# EAGLE design XuLA_VGA (EAGLE 5.11)
AUTHOR: Dave Vandenbout / XESS Corp.; DIGIKEY#: 742C083822JPCT-ND; JAMECO#: 68339; MANF: Jameco ValuePro; MANF#: SMH36; MOUSER#: 774-742C083561JP; VERSION#: 1.0
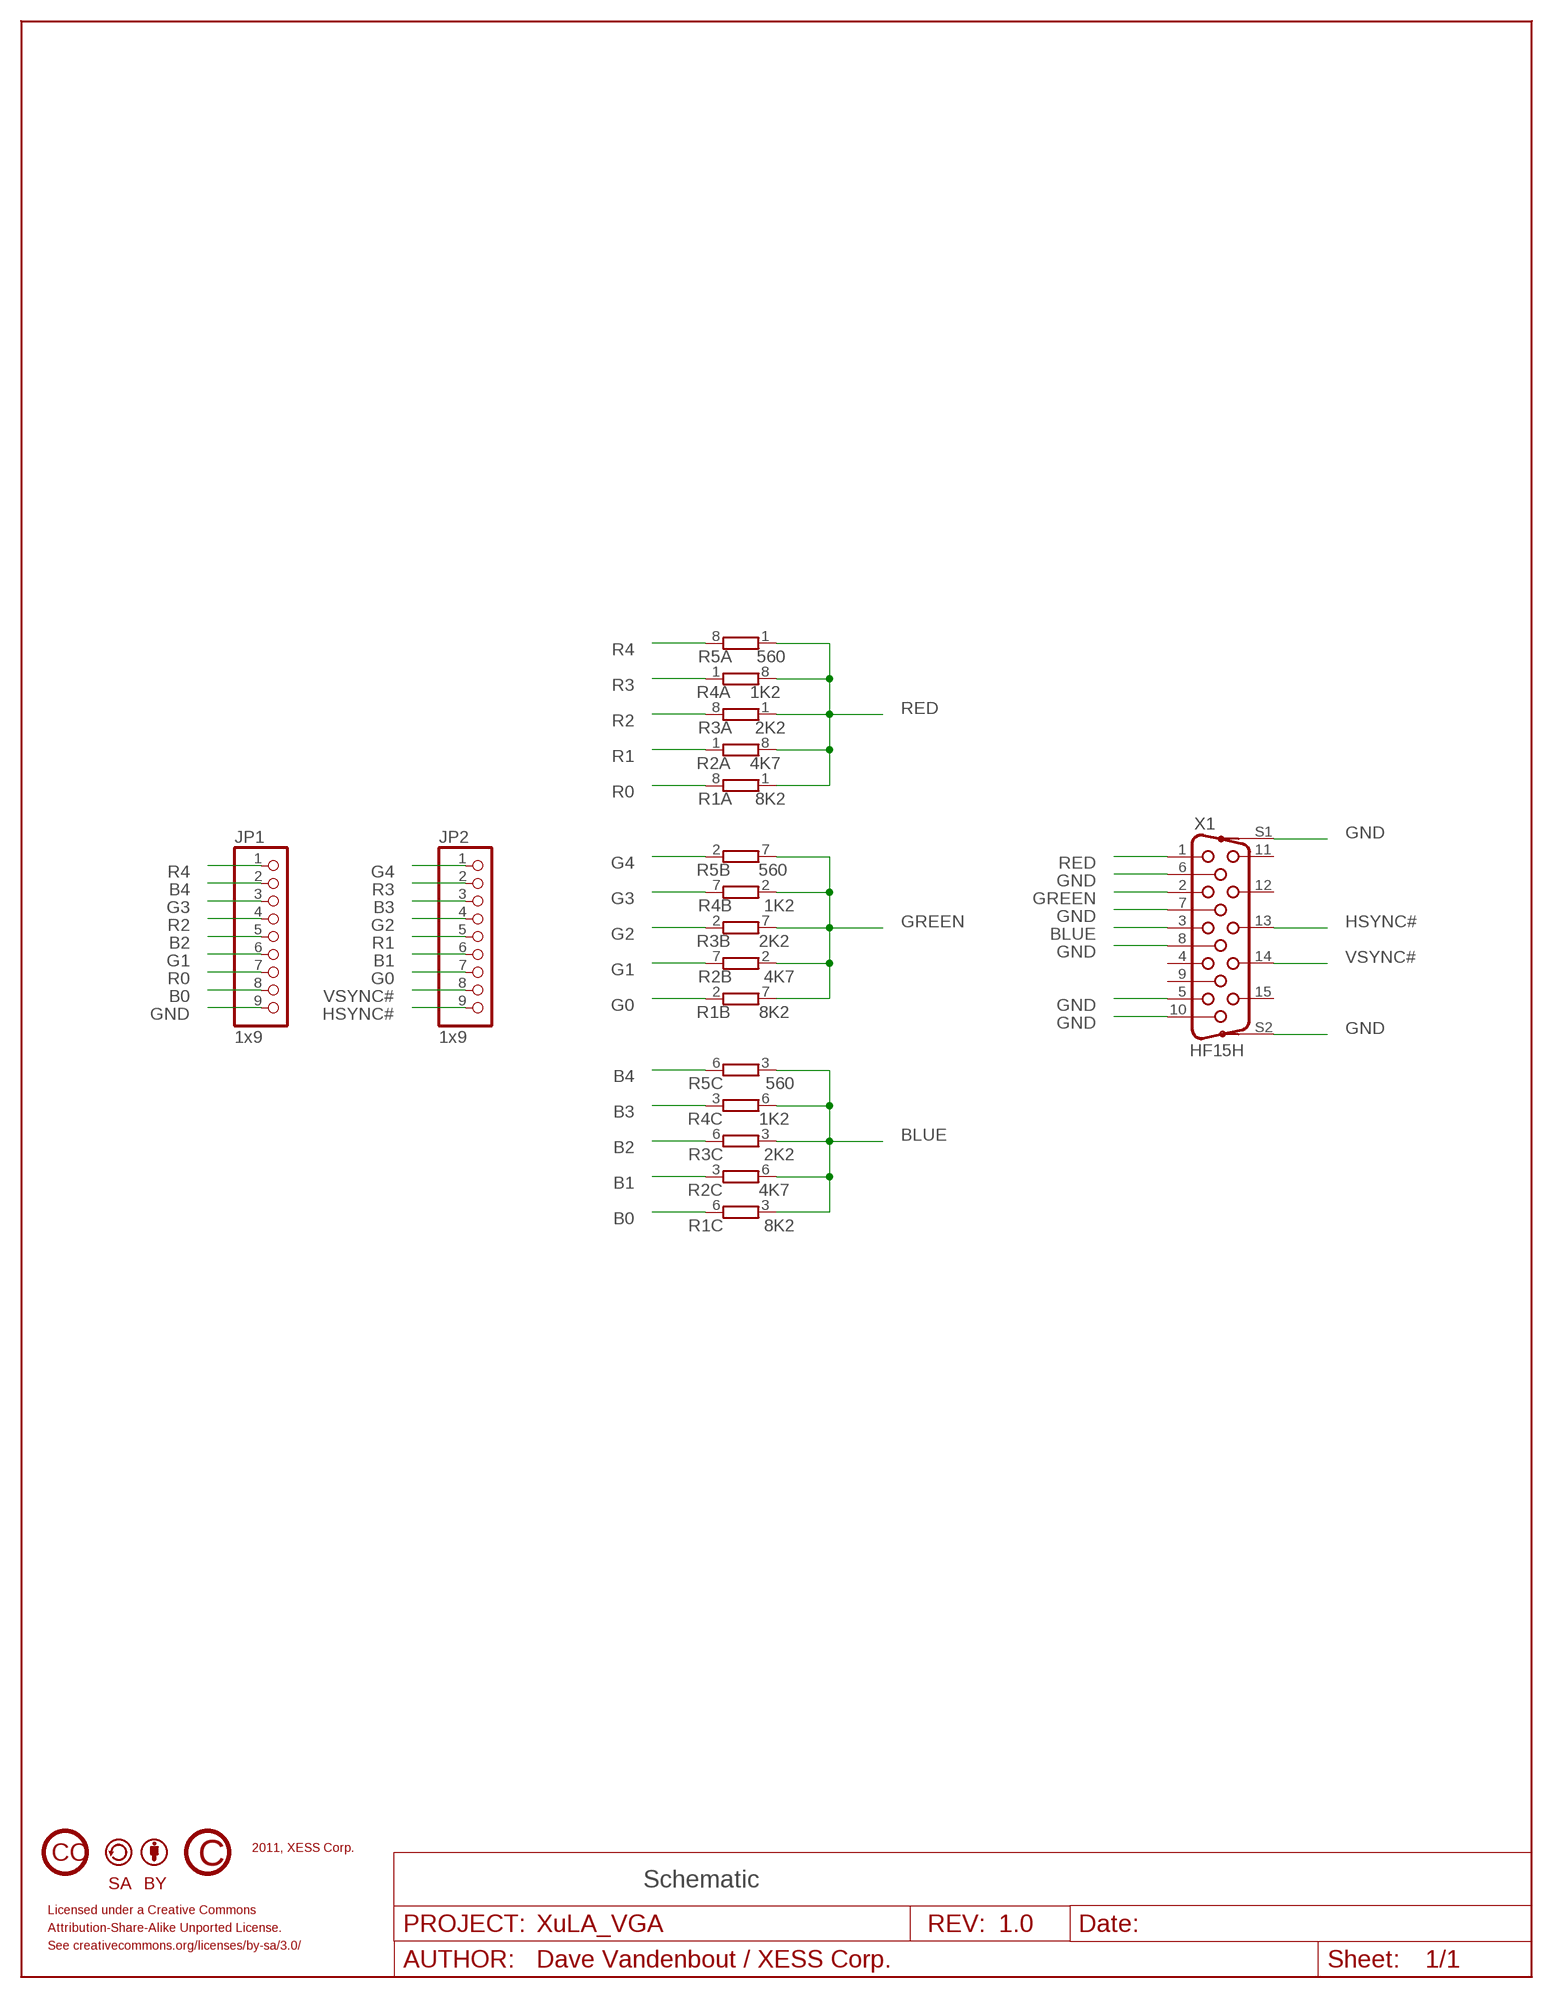
[diagram p0: schematic, sheet 1]

## Parts
JP1  1x9  PINHD-1X9  [1X09]
JP2  1x9  PINHD-1X9  [1X09]
R1  8K2  RES4742  [742C083]
R2  4K7  RES4742  [742C083]
R3  2K2  RES4742  [742C083]
R4  1K2  RES4742  [742C083]
R5  560  RES4742  [742C083]
U$1  CC_CC  [CC_CC]
U$2  CC_COPYRIGHT  [CC_COPYRIGHT]
U$3  CC_SA  [CC_SA]
U$4  CC_BY  [CC_BY]
X1  HF15H  [HDF15H]

## Nets
B0: JP1.8 R1.6
B1: JP2.6 R2.3
B2: JP1.5 R3.6
B3: JP2.3 R4.3
B4: JP1.2 R5.6
BLUE: R1.3 R2.6 R3.3 R4.6 R5.3 X1.3
G0: JP2.7 R1.2
G1: JP1.6 R2.7
G2: JP2.4 R3.2
G3: JP1.3 R4.7
G4: JP2.1 R5.2
GND: JP1.9 X1.5 X1.6 X1.7 X1.8 X1.10 X1.S1 X1.S2
GREEN: R1.7 R2.2 R3.7 R4.2 R5.7 X1.2
HSYNC#: JP2.9 X1.13
R0: JP1.7 R1.8
R1: JP2.5 R2.1
R2: JP1.4 R3.8
R3: JP2.2 R4.1
R4: JP1.1 R5.8
RED: R1.1 R2.8 R3.1 R4.8 R5.1 X1.1
VSYNC#: JP2.8 X1.14
Unconnected: R1.4 R1.5 R2.4 R2.5 R3.4 R3.5 R4.4 R4.5 R5.4 R5.5 X1.4 X1.9 X1.11 X1.12 X1.15

## Notes on the sheet
- 2011, XESS Corp.
- Schematic
- Licensed under a Creative Commons
- Attribution-Share-Alike Unported License.
- See creativecommons.org/licenses/by-sa/3.0/

## Library data of the parts
JP1 JP2 = pinhead:PINHD-1X9: PIN HEADER
R1-R5 = xess:RES4: Resistor 4-pack Package of four resistors.
U$1 = xess:CC_CC
U$2 = xess:CC_COPYRIGHT
U$3 = xess:CC_SA
U$4 = xess:CC_BY
X1 = xess:HF15H: High-density, 15-pin SUB-D connector.

## Board
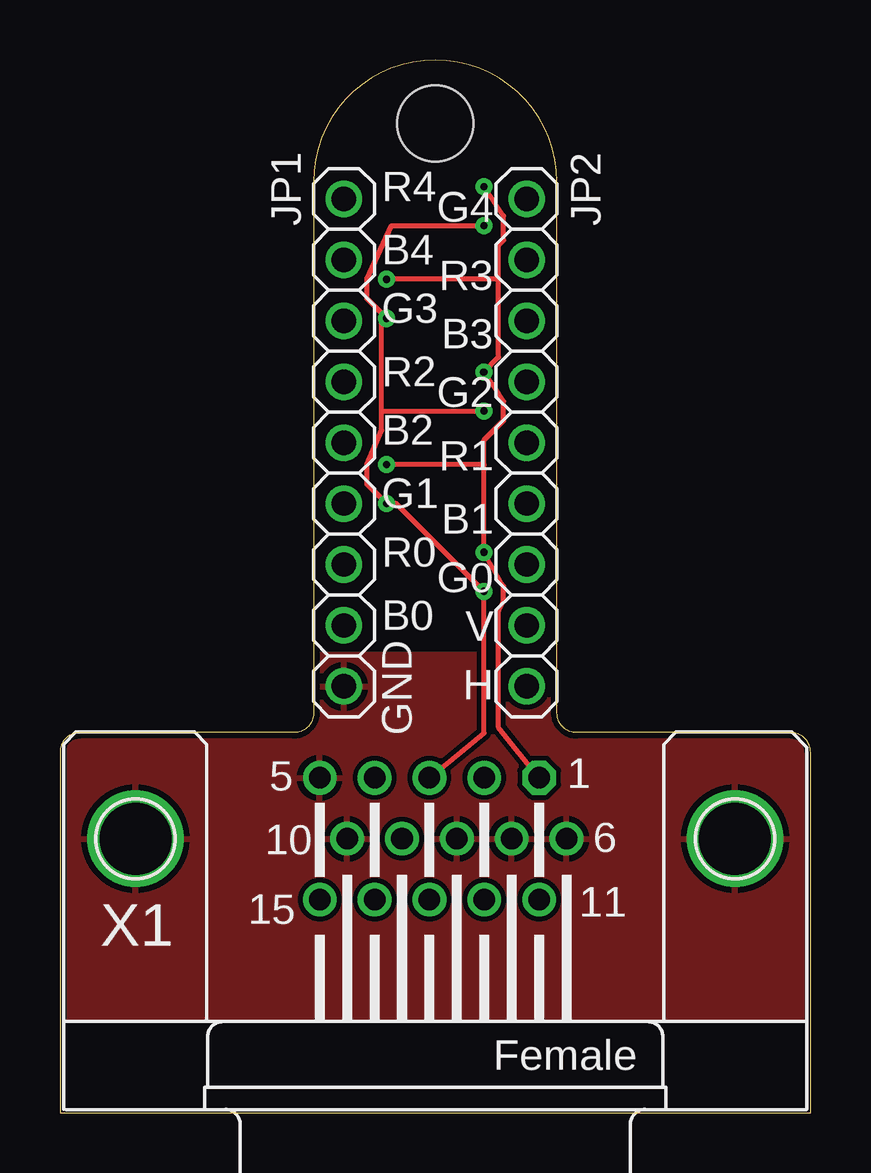
[diagram p1: board, top side]
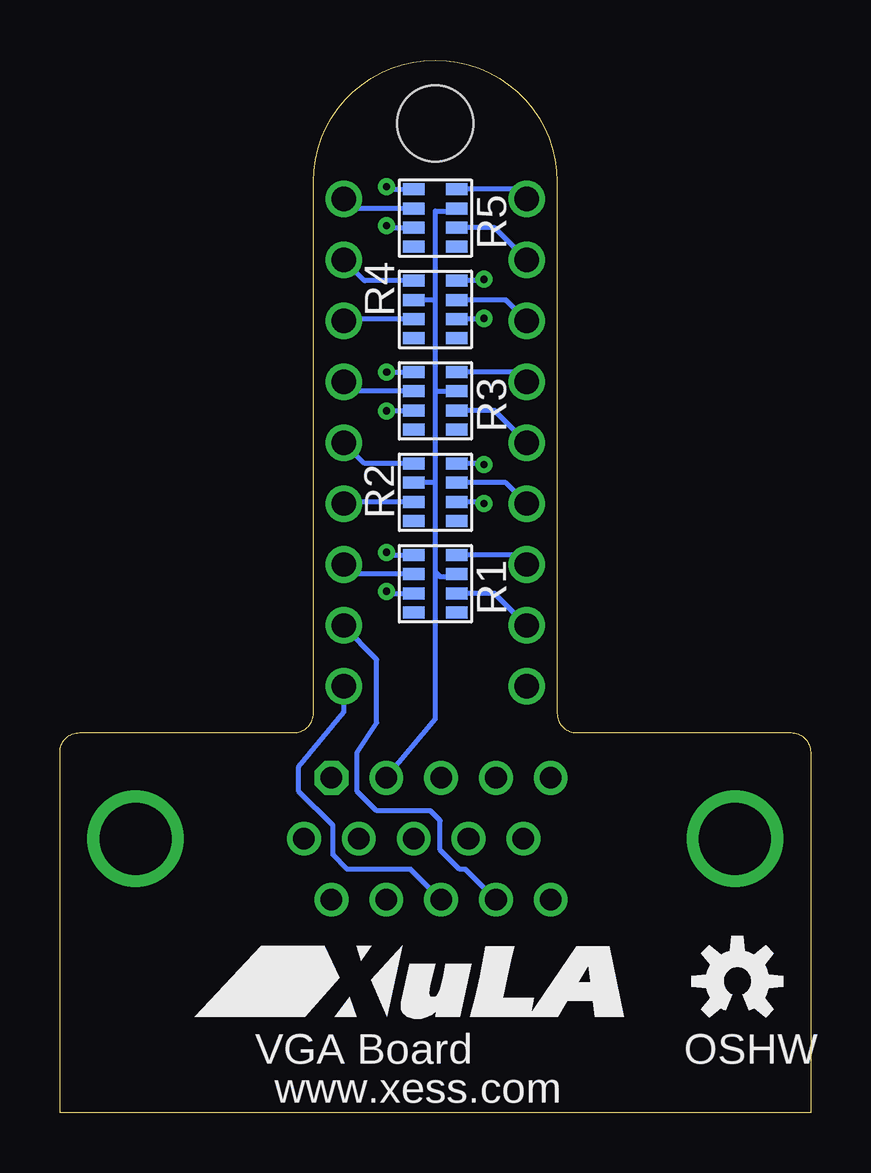
[diagram p2: board, bottom side, seen from below]

Size 31.29 x 43.89 mm. Coordinates in mm from the lower left corner, seen from the top.
Outline: 0,0 31.29,0 31.29,15.04 arc90 30.48,15.85 21.54,15.85 arc-90 20.73,16.66 20.73,38.81 arc90 15.65,43.89 arc90 10.57,38.81 10.57,16.66 arc-90 9.75,15.85 0.81,15.85 arc90 0,15.04 0,0
Copper layers (1*16): Top 0.035mm / dielectric 1.5mm / Bottom 0.035mm
Design rules "ITeadstudio_safe": minimum track width 8mil, minimum drill 12mil, track to track 8mil, track to pad 8mil, pad to pad 8mil, via to via 8mil, smd to smd 0mil, copper to edge 10mil, drill to drill 10mil, minimum pad ring 10mil, minimum via ring 8mil, stop-mask expansion 2mil, vias tented up to drill 100mil, thermal gap 10mil
Holes 3.17 mm at 15.65,41.25

### Footprints (pad centres in the part's own frame; a part is rotated, then mirrored left to right if it is on the bottom)
1X09 = drill 1.016 round: 1 -10.16,0; 2 -7.62,0; 3 -5.08,0; 4 -2.54,0; 5 0,0; 6 2.54,0; 7 5.08,0; 8 7.62,0; 9 10.16,0
742C083 = smd 0.5 x 0.9: 1 -0.4,-0.9; 2 0.4,-0.9; 3 1.2,-0.9; 4 2,-0.9; 5 2,0.9; 6 1.2,0.9; 7 0.4,0.9; 8 -0.4,0.9
HDF15H = drill 0.9 octagon: 1 4.329,2.54 | drill 0.9 round: 2 2.043,2.54; 3 -0.243,2.54; 4 -2.529,2.54; 5 -4.815,2.54; 6 5.472,0; 7 3.186,0; 8 0.9,0; 9 -1.386,0; 10 -3.672,0; 11 4.329,-2.54; 12 2.043,-2.54; 13 -0.243,-2.54; 14 -2.529,-2.54; 15 -4.815,-2.54 | drill 3 round: S1 -12.499,0; S2 12.499,0

### Placement (x,y rotation side)
JP1  11.84,27.94 270 top
JP2  19.46,27.94 270 top
R1  15.65,22.86 270 bottom
R2  15.65,26.67 270 bottom
R3  15.65,30.48 270 bottom
R4  15.65,34.29 270 bottom
R5  15.65,38.1 270 bottom
U$1  13.97,-11.43 0 top  (outside the outline)
U$2  6.35,-11.43 0 top  (outside the outline)
U$3  20.32,-11.43 0 top  (outside the outline)
U$4  25.4,-11.43 0 top  (outside the outline)
X1  15.65,11.43 0 top

### Tracks (layer width: path | path; a pad name or v marks a point on that pad's centre or on a via)
B0
  Bottom 0.203: R1.6 13.18,21.66 JP1.8
B1
  Bottom 0.203: R2.3 19.39,25.47 JP2.6
B2
  Bottom 0.203: R3.6 13.18,29.28 JP1.5
B3
  Bottom 0.203: R4.3 19.39,33.09 JP2.3
B4
  Bottom 0.203: R5.6 13.18,36.9 JP1.2
BLUE  (via drill 0.3)
  Top 0.203: v17.68,36.98 13.82,36.98 12.8,34.75 12.8,33.93 v13.61,33.12 13.41,32.92 13.41,29.26 | 13.41,29.26 13.41,28.45 12.8,27.03 12.8,26.21 v13.61,25.4 14.02,25.4 v17.68,21.74 17.68,15.84 X1.3 | 13.41,29.26 v17.68,29.26
  Bottom 0.203: R5.3 17.6,36.9 v17.68,36.98 | R4.6 13.65,33.09 v13.61,33.12 | R3.3 17.66,29.28 v17.68,29.26 | R2.6 13.68,25.47 v13.61,25.4 | R1.3 17.6,21.66 v17.68,21.74
G0
  Bottom 0.203: R1.2 19.06,22.46 JP2.7
G1
  Bottom 0.203: R2.7 12.71,26.27 JP1.6
G2
  Bottom 0.203: R3.2 19.06,30.08 JP2.4
G3
  Bottom 0.203: R4.7 12.71,33.89 JP1.3
G4
  Bottom 0.203: R5.2 19.06,37.7 JP2.1
GND
  pour Top: 20.73,19.1 10.57,19.1 10.57,15.85 0,15.85 0,3.86 31.09,3.86 31.09,15.85 20.73,15.85
GREEN
  Bottom 0.203: R5.7 14.75,37.68 14.83,37.59 15.65,37.59 15.65,33.93 | 15.65,22.55 15.65,16.42 X1.2 | 15.65,22.55 15.65,26.21 | 15.65,26.21 15.65,30.07 | 15.65,30.07 15.65,33.93 | R4.2 15.69,33.89 15.65,33.93 | R3.7 15.64,30.08 15.65,30.07 | R2.2 15.7,26.27 15.65,26.21 | R1.7 14.75,22.44 14.83,22.35 15.44,22.35 15.65,22.55
HSYNC#
  Bottom 0.203: JP2.9 19.46,16.71 21.34,14.43 21.34,13.41 19.91,11.99 19.91,10.77 19.3,10.16 16.67,10.16 X1.13
R0
  Bottom 0.203: R1.8 12.24,23.26 JP1.7
R1
  Bottom 0.203: R2.1 18.59,27.07 JP2.5
R2
  Bottom 0.203: R3.8 12.24,30.88 JP1.4
R3
  Bottom 0.203: R4.1 18.59,34.69 JP2.2
R4
  Bottom 0.203: R5.8 12.24,38.5 JP1.1
RED  (via drill 0.3)
  Top 0.203: v17.68,38.61 18.49,37.39 18.49,36.37 18.29,36.17 18.29,34.75 | 18.29,34.75 18.29,31.5 v17.67,30.88 18.09,30.28 18.49,29.67 18.49,28.85 17.68,28.04 17.68,27.03 | 17.68,27.03 v17.68,23.37 18.49,21.95 18.49,21.34 18.29,20.93 18.29,16.06 X1.1 | 18.29,34.75 v13.61,34.75 | 17.68,27.03 v13.61,27.03
  Bottom 0.203: R5.1 17.57,38.5 v17.68,38.61 | R4.8 13.67,34.69 v13.61,34.75 | v17.67,30.88 R3.1 | R2.8 13.77,27.07 v13.61,27.03 | R1.1 17.57,23.26 v17.68,23.37
VSYNC#
  Bottom 0.203: JP2.8 19.46,20.27 18.09,18.9 18.09,16.26 18.9,15.04 18.9,13.41 18.09,12.6 15.85,12.6 15.44,12.19 15.44,10.97 14.63,10.16 14.39,10.16 X1.14

### Text on the board
bPlace: OSHW | VGA Board | www.xess.com
tNames: R4 | G4 | R3 | B4 | G3 | B3 | G2 | R2 | B2 | R1 | G1 | B1 | R0 | G0 | V | B0 | GND | H